# Altium schematic sheet 以太网透传模块.SchDoc
size A4
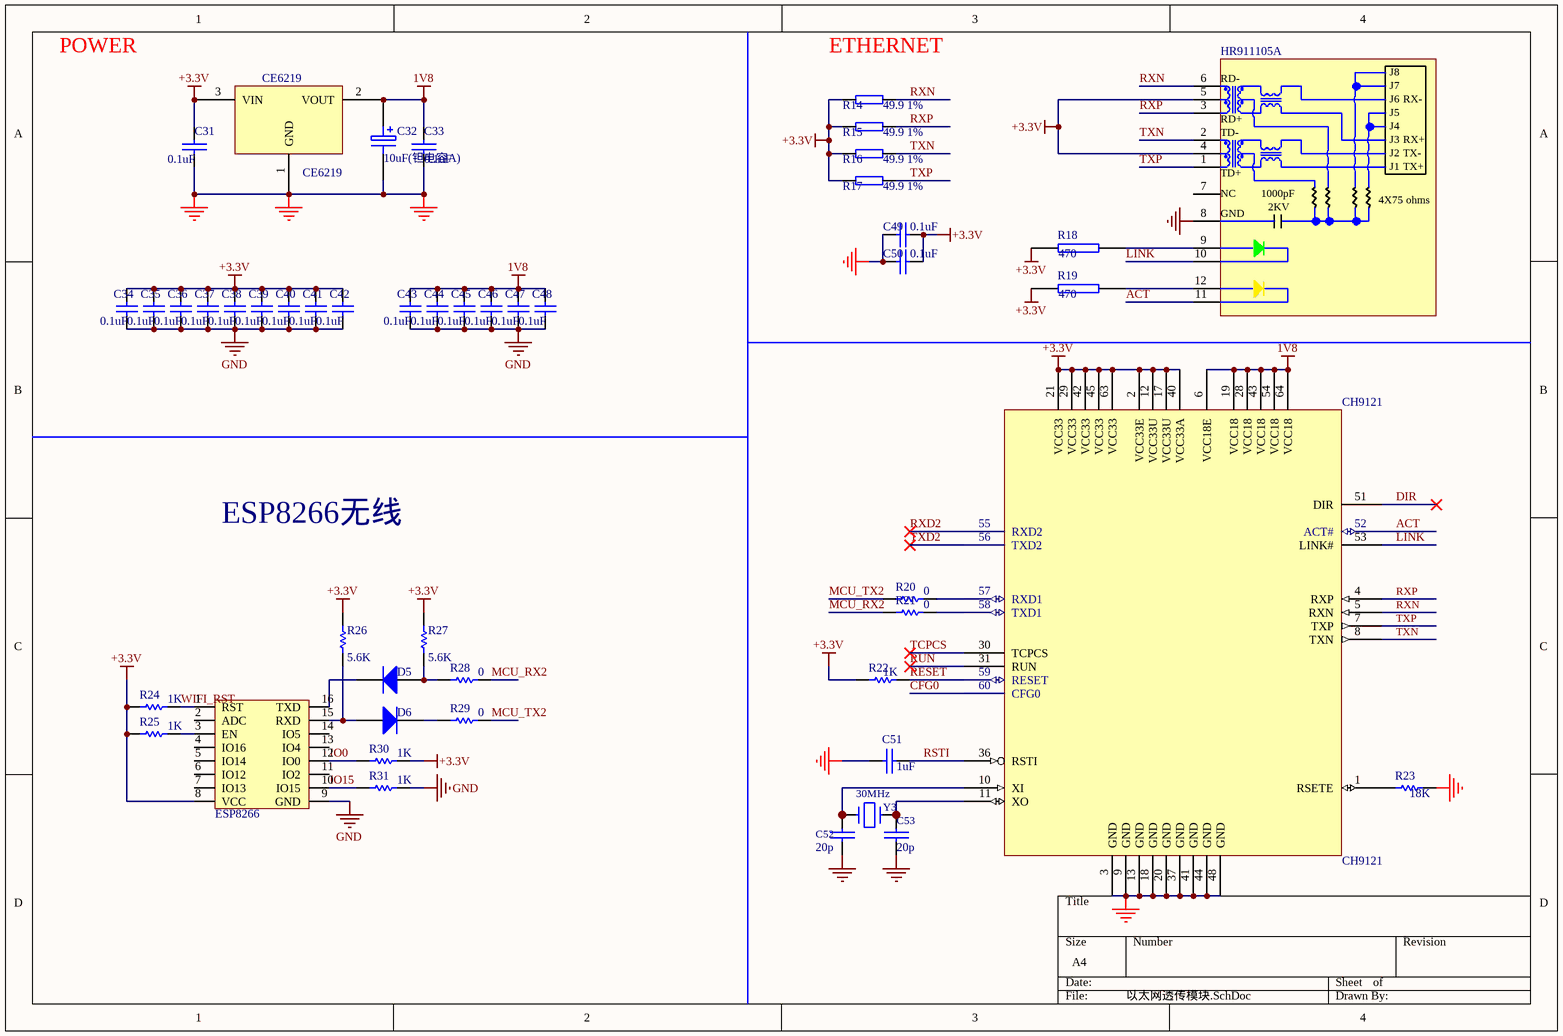
[diagram p0: 以太网透传模块.SchDoc]

## Parts
C31  104  [0603]  (value not drawn)
C32  10uF(钽电容A)  [钽电容(A)]
C33  104  [0603]  (value not drawn)
C34  value 0.1uF  [0603]  (hidden comment: 104)
C35  value 0.1uF  [0603]  (hidden comment: 104)
C36  value 0.1uF  [0603]  (hidden comment: 104)
C37  value 0.1uF  [0603]  (hidden comment: 104)
C38  value 0.1uF  [0603]  (hidden comment: 104)
C39  value 0.1uF  [0603]  (hidden comment: 104)
C40  value 0.1uF  [0603]  (hidden comment: 104)
C41  value 0.1uF  [0603]  (hidden comment: 104)
C42  value 0.1uF  [0603]  (hidden comment: 104)
C43  value 0.1uF  [0603]  (hidden comment: 104)
C44  value 0.1uF  [0603]  (hidden comment: 104)
C45  value 0.1uF  [0603]  (hidden comment: 104)
C46  value 0.1uF  [0603]  (hidden comment: 104)
C47  value 0.1uF  [0603]  (hidden comment: 104)
C48  value 0.1uF  [0603]  (hidden comment: 104)
C49  104  [0603]  (value not drawn)
C50  104  [0603]  (value not drawn)
C51  105  [0603]  (value not drawn)
C52  20  [0603]  (value not drawn)
C53  20  [0603]  (value not drawn)
CE6219  CE6219  [SOT-23]
CH9121  CH9121  [LQFP64_10x10]
D5  IN5819  [SOD-123]  (value not drawn)
D6  IN5819  [SOD-123]  (value not drawn)
ESP8266  ESP8266  [ESP8266]  (value not drawn)
HR911105A  HR911105A  [HR911105A]  (value not drawn)
R14  49.9 1%  [0603]
R15  49.9 1%  [0603]
R16  49.9 1%  [0603]
R17  49.9 1%  [0603]
R18  470  [0603]
R19  470  [0603]
R20  0  [0603]
R21  0  [0603]
R22  1K  [0603]
R23  18K  [0603]
R24  1K  [0603]
R25  1K  [0603]
R26  5.6K  [0603]
R27  5.6K  [0603]
R28  0  [0603]
R29  0  [0603]
R30  1K  [0603]
R31  1K  [0603]
Y3  30MHz  [4025]

## Nets
1V8: C32.1 C33.1 C43.1 C44.1 C45.1 C46.1 C47.1 C48.1 CE6219.2(VOUT) CH9121.6(VCC18E) CH9121.19(VCC18) CH9121.28(VCC18) CH9121.43(VCC18) CH9121.54(VCC18) CH9121.64(VCC18)
+3.3V: C31.1 C34.1 C35.1 C36.1 C37.1 C38.1 C39.1 C40.1 C41.1 C42.1 C49.1 C50.1 CE6219.3(VIN) CH9121.2(VCC33E) CH9121.12(VCC33U) CH9121.17(VCC33U) CH9121.21(VCC33) CH9121.29(VCC33) CH9121.40(VCC33A) CH9121.42(VCC33) CH9121.45(VCC33) CH9121.63(VCC33) ESP8266.8(VCC) HR911105A.4 HR911105A.5 R14.1 R15.1 R16.1 R17.1 R18.1 R19.1 R22.1 R24.1 R25.1 R26.2 R27.2 R30.2
GND: C31.2 C32.2 C33.2 C34.2 C35.2 C36.2 C37.2 C38.2 C39.2 C40.2 C41.2 C42.2 C43.2 C44.2 C45.2 C46.2 C47.2 C48.2 C49.2 C50.2 C51.1 C52.2 C53.2 CE6219.1(GND) CH9121.3(GND) CH9121.9(GND) CH9121.13(GND) CH9121.18(GND) CH9121.20(GND) CH9121.37(GND) CH9121.41(GND) CH9121.44(GND) CH9121.48(GND) ESP8266.9(GND) HR911105A.8 R23.2 R31.2
ACT: CH9121.52(ACT#) HR911105A.11
CFG0: CH9121.60(CFG0)
DIR: CH9121.51(DIR)
IO0: ESP8266.12(IO0) R30.1
IO15: ESP8266.10(IO15) R31.1
LINK: CH9121.53(LINK#) HR911105A.10
MCU_RX2: R21.1 R28.2
MCU_TX2: R20.1 R29.2
RESET: CH9121.59(RESET) R22.2
RSTI: C51.2 CH9121.36(RSTI)
RUN: CH9121.31(RUN)
RXD2: CH9121.55(RXD2)
RXN: CH9121.5(RXN) HR911105A.6 R14.2
RXP: CH9121.4(RXP) HR911105A.3 R15.2
TCPCS: CH9121.30(TCPCS)
TXD2: CH9121.56(TXD2)
TXN: CH9121.8(TXN) HR911105A.2 R16.2
TXP: CH9121.7(TXP) HR911105A.1 R17.2
WIFI_RST: ESP8266.1(RST) R24.2
NetC52_1: C52.1 CH9121.10(XI) Y3.1
NetC53_1: C53.1 CH9121.11(XO) Y3.2
NetCH9121_1: CH9121.1(RSETE) R23.1
NetCH9121_57: CH9121.57(RXD1) R20.2
NetCH9121_58: CH9121.58(TXD1) R21.2
NetD5_1: D5.1(A) R27.1 R28.1
NetD5_2: D5.2(K) ESP8266.16(TXD)
NetD6_1: D6.1(A) ESP8266.15(RXD) R26.1
NetD6_2: D6.2(K) R29.1
NetESP8266_3: ESP8266.3(EN) R25.2
NetHR911105A_9: HR911105A.9 R18.2
NetHR911105A_12: HR911105A.12 R19.2

Not connected (* = marked no-connect by the designer): ESP8266 2(ADC) 4(IO16) 5(IO14) 6(IO12) 7(IO13) 11(IO2) 13(IO4) 14(IO5); HR911105A 7

## Notes on the sheet
- POWER
- (near R14) ETHERNET
- ESP8266无线
- (in symbol CAP) 0.1uF; 1uF
- (in symbol HR911105A) J8; RD-; J7; J6; RX-; J5; RD+; J4; TD-; J3; RX+; J2; TX-; J1; TX+; TD+; NC; 1000pF; 4X75 ohms; 2KV; GND
- (in symbol Pro1BB.tmp_20p_7) 20p

## Library data of the parts
C31 C33 C49-C51 = CAP: Capacitor
C32 = ELECTRO1: Electrolytic Capacitor
C34-C48 = Cap: Capacitor; Published: 8-Jun-2000; LatestRevisionDate: 17-Jul-2002; LatestRevisionNote: Re-released for DXP Platform.; PackageReference: RAD-0.3; Publisher: Altium Limited
C52 C53 = Pro1BB.tmp_20p_7
CE6219 = LM1117_3.3V
D5 D6 = Diode 1N4001: 1 Amp General Purpose Rectifier; Published: 8-Jun-2000; LatestRevisionDate: 17-Jul-2002; LatestRevisionNote: Re-released for DXP Platform.; DatasheetVersion: 1998; PackageVersion: Aug-1999; PackageReference: DO-41; Publisher: Altium Limited; PackageDescription: Diode, Axial; Body 5.2 x 2.7 mm (LxDia. max), Lead Dia. 0.86 mm (max); Code_JEDEC: DO-204-AL; ComponentLink1Description: Manufacturer Link; ComponentLink1URL: http://www.fairchildsemi.com/; ComponentLink2Description: Datasheet; ComponentLink2URL: http://www.fairchildsemi.com/ds/1N%2F1N4001.pdf
R14-R17 = DZ
R18 R19 = RES2
R20-R31 = Res1: Resistor; Published: 8-Jun-2000; LatestRevisionDate: 17-Jul-2002; LatestRevisionNote: Re-released for DXP Platform.; PackageReference: AXIAL-0.3; Publisher: Altium Limited; PackageDescription: Axial Device, Thru-Hole; 2 Leads; 0.3 in Pin Spacing
  R20 R21 R28 R29: Value: 0
  R22 R24 R25 R30 R31: Value: 1K
  R23: Value: 18K
  R26 R27: Value: 5.6K
Y3 = Pro1BB.tmp_12MHz_6